# EAGLE design ChessComputer (EAGLE 7.6.0)

## Sheet 1 of 2
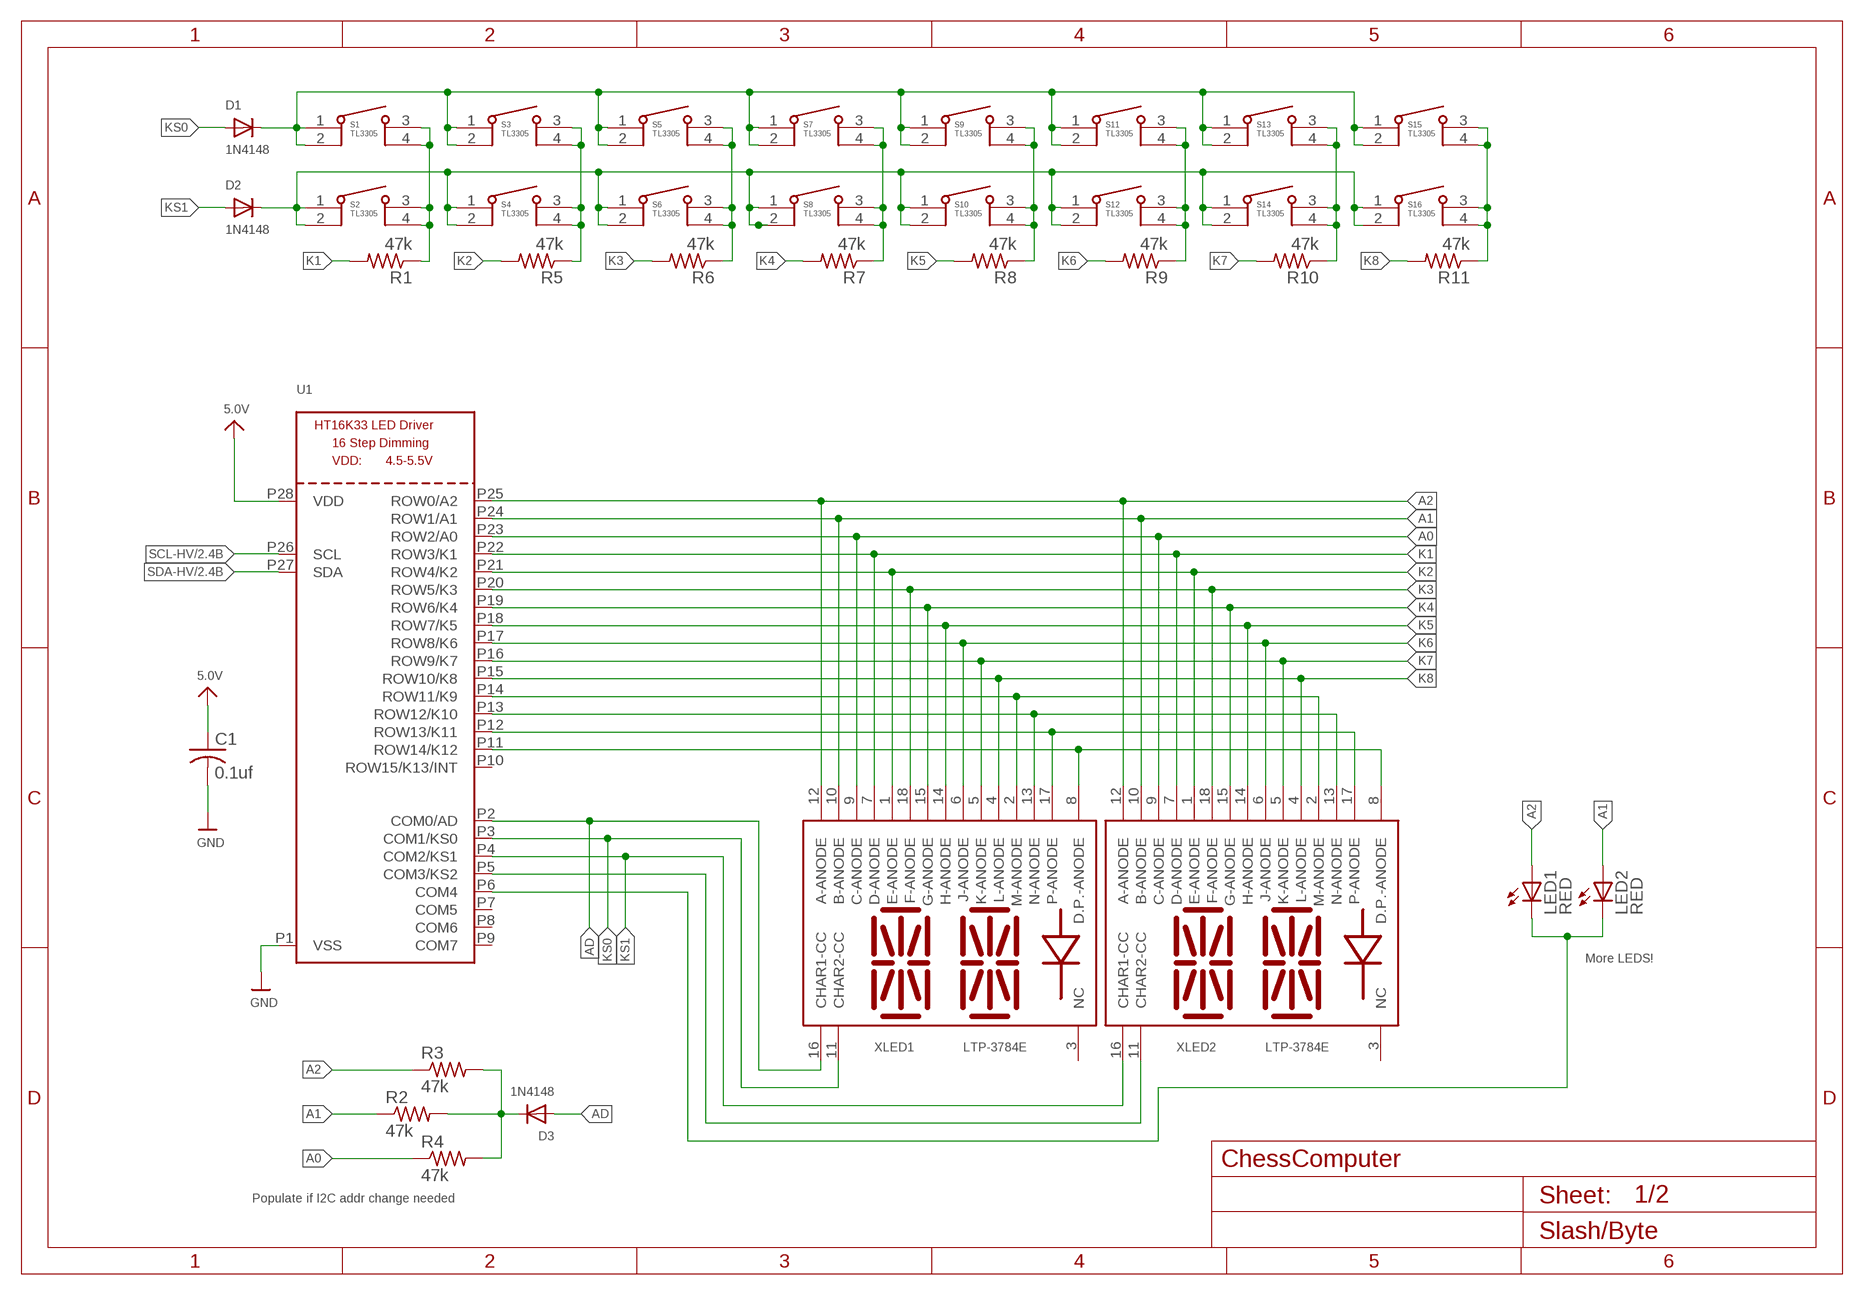
[diagram p0: schematic, sheet 1]

### Parts
C1  0.1uf  C-USC0805K  [C0805K]
D1  1N4148  DIODESOD-523  [SOD-523]
D2  1N4148  DIODESOD-523  [SOD-523]
D3  1N4148  DIODESOD-523  [SOD-523]
LED1  RED  LED3MM  [LED3MM]
LED2  RED  LED3MM  [LED3MM]
R1  47k  R-US_M0805  [M0805]
R2  47k  R-US_M0805  [M0805]
R3  47k  R-US_M0805  [M0805]
R4  47k  R-US_M0805  [M0805]
R5  47k  R-US_M0805  [M0805]
R6  47k  R-US_M0805  [M0805]
R7  47k  R-US_M0805  [M0805]
R8  47k  R-US_M0805  [M0805]
R9  47k  R-US_M0805  [M0805]
R10  47k  R-US_M0805  [M0805]
R11  47k  R-US_M0805  [M0805]
S1  TL3305  [TL3305]
S2  TL3305  [TL3305]
S3  TL3305  [TL3305]
S4  TL3305  [TL3305]
S5  TL3305  [TL3305]
S6  TL3305  [TL3305]
S7  TL3305  [TL3305]
S8  TL3305  [TL3305]
S9  TL3305  [TL3305]
S10  TL3305  [TL3305]
S11  TL3305  [TL3305]
S12  TL3305  [TL3305]
S13  TL3305  [TL3305]
S14  TL3305  [TL3305]
S15  TL3305  [TL3305]
S16  TL3305  [TL3305]
U1  HT16K33_SOP28  [SOP28_300MIL]
XLED1  LTP-3784E  [TLP-3784E]
XLED2  LTP-3784E  [TLP-3784E]

### Nets
5.0V: C1.1 U1.P28(VDD) ; also sheet 2
A0: R4.1 U1.P23(ROW2/A0) XLED1.9(C-ANODE) XLED2.9(C-ANODE)
A1: LED2.A R2.1 U1.P24(ROW1/A1) XLED1.10(B-ANODE) XLED2.10(B-ANODE)
A2: LED1.A R3.1 U1.P25(ROW0/A2) XLED1.12(A-ANODE) XLED2.12(A-ANODE)
AD: D3.A U1.P2(COM0/AD) XLED1.16(CHAR1-CC)
GND: C1.2 U1.P1(VSS) ; also sheet 2
K1: R1.2 U1.P22(ROW3/K1) XLED1.7(D-ANODE) XLED2.7(D-ANODE)
K2: R5.2 U1.P21(ROW4/K2) XLED1.1(E-ANODE) XLED2.1(E-ANODE)
K3: R6.2 U1.P20(ROW5/K3) XLED1.18(F-ANODE) XLED2.18(F-ANODE)
K4: R7.2 U1.P19(ROW6/K4) XLED1.15(G-ANODE) XLED2.15(G-ANODE)
K5: R8.2 U1.P18(ROW7/K5) XLED1.14(H-ANODE) XLED2.14(H-ANODE)
K6: R9.2 U1.P17(ROW8/K6) XLED1.6(J-ANODE) XLED2.6(J-ANODE)
K7: R10.2 U1.P16(ROW9/K7) XLED1.5(K-ANODE) XLED2.5(K-ANODE)
K8: R11.2 U1.P15(ROW10/K8) XLED1.4(L-ANODE) XLED2.4(L-ANODE)
KS0: D1.A U1.P3(COM1/KS0) XLED1.11(CHAR2-CC)
KS1: D2.A U1.P4(COM2/KS1) XLED2.16(CHAR1-CC)
N$5: LED1.K(C) LED2.K(C) U1.P6(COM4)
N$12: U1.P14(ROW11/K9) XLED1.2(M-ANODE) XLED2.2(M-ANODE)
N$13: U1.P13(ROW12/K10) XLED1.13(N-ANODE) XLED2.13(N-ANODE)
N$14: U1.P12(ROW13/K11) XLED1.17(P-ANODE) XLED2.17(P-ANODE)
N$15: U1.P11(ROW14/K12) XLED1.8(D.P.-ANODE) XLED2.8(D.P.-ANODE)
N$17: D2.K(C) S2.1 S2.2 S4.1 S4.2 S6.1 S6.2 S8.1 S8.2 S10.1 S10.2 S12.1 S12.2 S14.1 S14.2 S16.1 S16.2
N$18: U1.P5(COM3/KS2) XLED2.11(CHAR2-CC)
N$22: D3.K(C) R2.2 R3.2 R4.2
N$25: R1.1 S1.3 S1.4 S2.3 S2.4
N$26: R5.1 S3.3 S3.4 S4.3 S4.4
N$32: R6.1 S5.3 S5.4 S6.3 S6.4
N$33: R7.1 S7.3 S7.4 S8.3 S8.4
N$34: R8.1 S9.3 S9.4 S10.3 S10.4
N$35: R9.1 S11.3 S11.4 S12.3 S12.4
N$37: D1.K(C) S1.1 S1.2 S3.1 S3.2 S5.1 S5.2 S7.1 S7.2 S9.1 S9.2 S11.1 S11.2 S13.1 S13.2 S15.1 S15.2
N$38: R10.1 S13.3 S13.4 S14.3 S14.4
N$39: R11.1 S15.3 S15.4 S16.3 S16.4
SCL-HV: U1.P26(SCL) ; also sheet 2
SDA-HV: U1.P27(SDA) ; also sheet 2
Unconnected: U1.P7(COM5) U1.P8(COM6) U1.P9(COM7) U1.P10(ROW15/K13/INT) XLED1.3(NC) XLED2.3(NC)

### Notes on the sheet
- More LEDS!
- Populate if I2C addr change needed

## Sheet 2 of 2
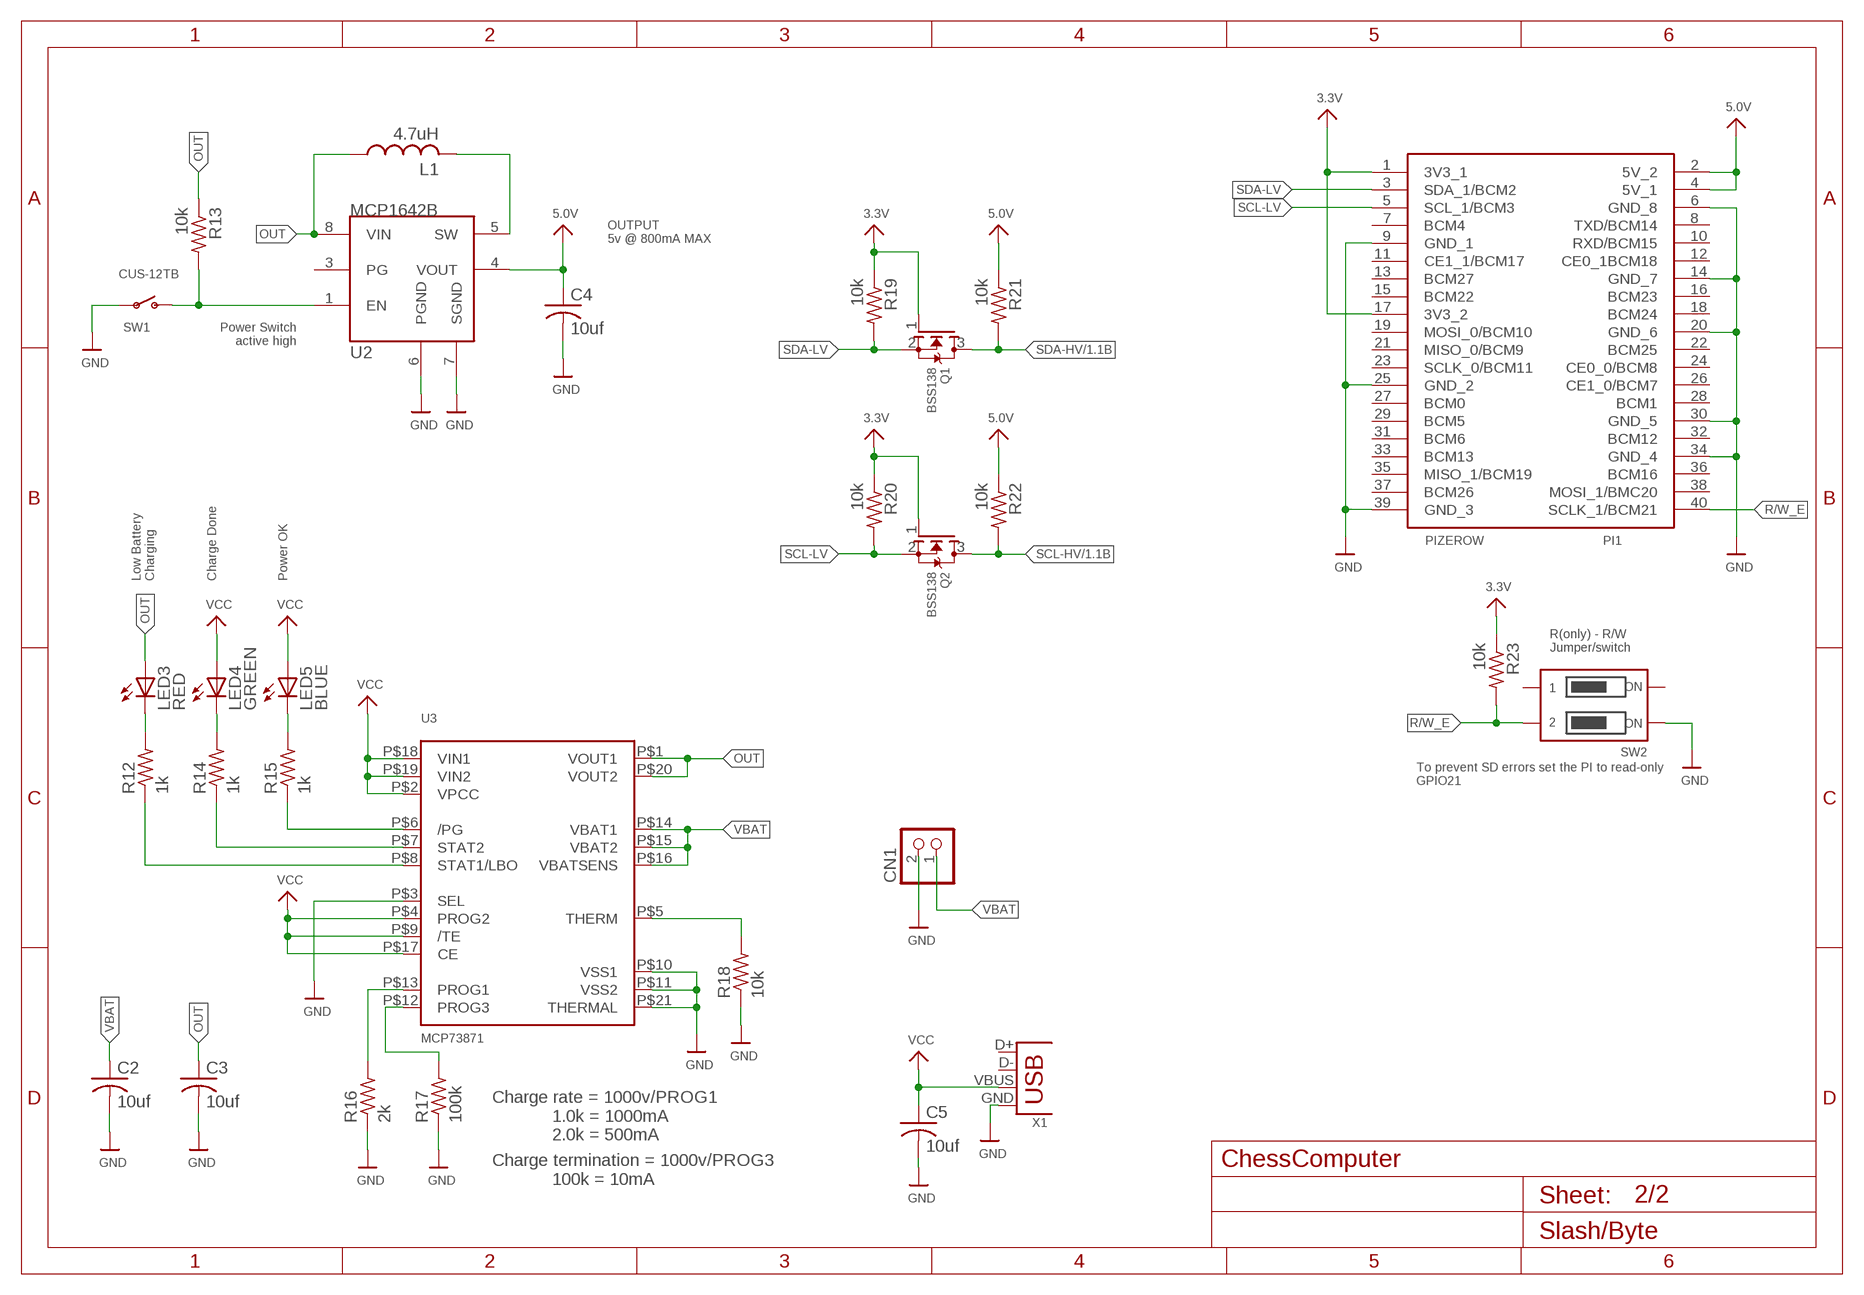
[diagram p1: schematic, sheet 2]

### Parts
C2  10uf  C-USC0805K  [C0805K]
C3  10uf  C-USC0805K  [C0805K]
C4  10uf  C-USC0805K  [C0805K]
C5  10uf  C-USC0805K  [C0805K]
CN1  JST_2PIN-SMT-RA  [JST-PH-2-SMT-RA]
L1  4.7uH  TYS60204R7N-10  [TYS60204R7N-10]
LED3  RED  LED3MM  [LED3MM]
LED4  GREEN  LED3MM  [LED3MM]
LED5  BLUE  LED3MM  [LED3MM]
PI1  PIZEROW  [RASP_PI_ZERO_BOARD_FULL]
Q1  BSS138  MOSFET-NREFLOW  [SOT23-R]
Q2  BSS138  MOSFET-NREFLOW  [SOT23-R]
R12  1k  R-US_M0805  [M0805]
R13  10k  R-US_M0805  [M0805]
R14  1k  R-US_M0805  [M0805]
R15  1k  R-US_M0805  [M0805]
R16  2k  R-US_M0805  [M0805]
R17  100k  R-US_M0805  [M0805]
R18  10k  R-US_M0805  [M0805]
R19  10k  R-US_M0805  [M0805]
R20  10k  R-US_M0805  [M0805]
R21  10k  R-US_M0805  [M0805]
R22  10k  R-US_M0805  [M0805]
R23  10k  R-US_M0805  [M0805]
SW1  CUS-12TB  SWITCH_SPST  [SPST_SMT_19192]
SW2  DIPSWITCH_2PIN  [DIPSWITCH_2PIN]
U2  MCP1642B  [MSOP8]
U3  MCP73871  [QFN20_4MM]
X1  MICRO-USB_ORIG  [DX4R005HJ5]

### Nets
3.3V: PI1.1(3V3_1) PI1.17(3V3_2) Q1.1(G) Q2.1(G) R19.1 R20.1 R23.1
5.0V: C4.1 PI1.2(5V_2) PI1.4(5V_1) R21.1 R22.1 U2.4(VOUT) ; also sheet 1
ENABLE: R13.2 SW1.C(S) U2.1(EN)
GND: C2.2 C3.2 C4.2 C5.2 CN1.2 PI1.6(GND_8) PI1.9(GND_1) PI1.14(GND_7) PI1.20(GND_6) PI1.25(GND_2) PI1.30(GND_5) PI1.34(GND_4) PI1.39(GND_3) R16.1 R17.1 R18.1 SW1.B(P) SW2.1A U2.6(PGND) U2.7(SGND) U3.P$3(SEL) U3.P$10(VSS1) U3.P$11(VSS2) U3.P$21(THERMAL) X1.GND ; also sheet 1
N$1: R18.2 U3.P$5(THERM)
N$2: R17.2 U3.P$12(PROG3)
N$3: R16.2 U3.P$13(PROG1)
N$4: L1.P$2 U2.5(SW)
N$6: R15.1 U3.P$6(/PG)
N$7: LED5.K(C) R15.2
N$8: LED4.K(C) R14.2
N$9: LED3.K(C) R12.2
N$10: R14.1 U3.P$7(STAT2)
N$11: R12.1 U3.P$8(STAT1/LBO)
OUT: C3.1 L1.P$1 LED3.A R13.1 U2.8(VIN) U3.P$1(VOUT1) U3.P$20(VOUT2)
R/W_E: PI1.40(SCLK_1/BCM21) R23.2 SW2.1B
SCL-HV: Q2.3(D) R22.2 ; also sheet 1
SCL-LV: PI1.5(SCL_1/BCM3) Q2.2(S) R20.2
SDA-HV: Q1.3(D) R21.2 ; also sheet 1
SDA-LV: PI1.3(SDA_1/BCM2) Q1.2(S) R19.2
VBAT: C2.1 CN1.1 U3.P$14(VBAT1) U3.P$15(VBAT2) U3.P$16(VBATSENS)
VCC: C5.1 LED4.A LED5.A U3.P$2(VPCC) U3.P$4(PROG2) U3.P$9(/TE) U3.P$17(CE) U3.P$18(VIN1) U3.P$19(VIN2) X1.VBUS
Unconnected: PI1.7(BCM4) PI1.8(TXD/BCM14) PI1.10(RXD/BCM15) PI1.11(CE1_1/BCM17) PI1.12(CE0_1BCM18) PI1.13(BCM27) PI1.15(BCM22) PI1.16(BCM23) PI1.18(BCM24) PI1.19(MOSI_0/BCM10) PI1.21(MISO_0/BCM9) PI1.22(BCM25) PI1.23(SCLK_0/BCM11) PI1.24(CE0_0/BCM8) PI1.26(CE1_0/BCM7) PI1.27(BCM0) PI1.28(BCM1) PI1.29(BCM5) PI1.31(BCM6) PI1.32(BCM12) PI1.33(BCM13) PI1.35(MISO_1/BCM19) PI1.36(BCM16) PI1.37(BCM26) PI1.38(MOSI_1/BMC20) SW2.2A SW2.2B U2.3(PG) X1.D+ X1.D-

### Notes on the sheet
- OUTPUT
  5v @ 800mA MAX
- Power Switch
  active high
- Low Battery
  Charging
- Charge Done | Power OK
- R(only) - R/W
  Jumper/switch
- To prevent SD errors set the PI to read-only
  GPIO21
- Charge rate = 1000v/PROG1
              1.0k = 1000mA
              2.0k = 500mA
- Charge termination = 1000v/PROG3
              100k = 10mA

## Library data of the parts
C1-C5 = adafruit:C-US: CAPACITOR, American symbol
CN1 = adafruit:JST_2PIN: JST 2-Pin Connectors of various flavors SMT-RA (S2B-PH-SM4) 4UConnector #17311 SMT (B2B-PH-SM4) THM-RA (S2B-PH) THM (B2B-PH)
D1-D3 = adafruit:DIODE: Diode SMADIODE - SMA Surface Mount Package 20V 1A Schottky Diode Digikey: 641-1014-6-ND DO-1N4148 - Through Hole Small Current Diode SOD-123 20V 1 A (.5mV Vf) Schottky Diode - Digikey: MBRX120TPMSCT-ND SOD-323 10V 570mA (.38mV Vf, 3ns) Schottky Diode - Digikey: ZLLS410CT-ND SOD-523 30V 30mA Schottky Diode (RB751S-40TE61) - Digikey: RB751S-40TE61CT-ND SOT23-R/W - SOT23 Package (R = Solder Paste/Reflow Ovens, W = Hand-Soldering) BAT54Film 40V 300mA - Digikey: 497-7162-1-ND
L1 = chessLib:TYS60204R7N-10: https://www.digikey.com/product-detail/en/laird-signal-integrity-products/TYS60204R7N-10/240-2724-1-ND/4733633
LED1-LED5 = adafruit:LED: LED OSRAM: - CHIPLED LG R971, LG N971, LY N971, LG Q971, LY Q971, LO R971, LY R971 LH N974, LH R974 LS Q976, LO Q976, LY Q976 LO Q996 - Hyper CHIPLED LW Q18S LB Q993, LB Q99A, LB R99A - SideLED LS A670, LO A670, LY A670, LG A670, LP A670 LB A673, LV A673, LT A673, LW A673 LH A674 LY A675 LS A676, LA A676, LO A676, LY A676, LW A676 LS A679, LY A679, LG A679 - Hyper Micro SIDELED® LS Y876, LA Y876, LO Y876, LY Y876 LT Y87S - SmartLED LW L88C, LW L88S LB L89C, LB L89S, LG L890 LS L89K, LO L89K, LY L89K LS L896, LA L896, LO L896, LY L896 - TOPLED LS T670, LO T670, LY T670, LG T670, LP T670 LSG T670, LSP T670, LSY T670, LOP T670, LYG T670 LG T671, LOG T671, LSG T671 LB T673, LV T673, LT T673, LW T673 LH T674 LS T676, LA T676, LO T676, LY T676, LB T676, LH T676, LSB T676, LW T676 LB T67C, LV T67C, LT T67C, LS T67K, LO T67K, LY T67K, LW E67C LS E67B, LA E67B, LO E67B, LY E67B, LB E67C, LV E67C, LT E67C LW T67C LS T679, LY T679, LG T679 LS T770, LO T770, LY T770, LG T770, LP T770 LB T773, LV T773, LT T773, LW T773 LH T774 LS E675, LA E675, LY E675, LS T675 LS T776, LA T776, LO T776, LY T776, LB T776 LHGB T686 LT T68C, LB T68C - Hyper Mini TOPLED® LB M676 - Mini TOPLED Santana® LG M470 LS M47K, LO M47K, LY M47K Source: http://www.osram.convergy.de/
PI1 = chessLib:PIZEROW
Q1 Q2 = microbuilder:MOSFET-N: N-Channel Mosfet LEGEND VDS: Voltage Drain-Source ID: Drain Current RDS(ON): Drain-Source On-State Resistance VGS(TH): Gate-Source Threshold Voltage CISS: Drain-Source Input Capacitance SOT-23 Name VDS ID RDS(ON) VGS(TH) CISS Order Number 2N7002E 60V 260mA 2.5 Ohm 2.5V @ 250uA 26.7pF @ 25V 2N7002ET1GOSTR-ND BSH103 30V 850mA 400 mOhm 400mV @ 1mA 83pF @ 24V BSH103,235-ND BSS138 60V 320mA 1.6 Ohm 1.5V @ 250uA 50pF @ 10V Mouser: 771-BSS138PW115 DMN2075U-7 20V 4.2A 38 mOhm 1V @ 250 uA 594.3pF @ 10V DMN2075U-7DICT-ND * BSS138 good choice for I2C level-shifting
R1-R23 = adafruit:R-US_: RESISTOR, American symbol
S1-S16 = chessLib:TL3305
SW1 = microbuilder:SWITCH_SPST: Switch - SPST 4UCon 19192 (6.7x2.6mm SMT)
SW2 = chessLib:DIPSWITCH_2PIN: DIP Switch - 2 Pin - [4UConnector: 19493]
U1 = microbuilder:HT16K33_SOP28
U2 = chessLib:MCP1642B: MCP1642B http://ww1.microchip.com/downloads/en/DeviceDoc/20005253A.pdf digikey: MCP1642B-50I/MS-ND
U3 = microbuilder:MCP73871: MCP73871 Lithium Polymer Battery Charger Digikey: MCP73871-2CCI/ML-ND
X1 = fab:MICRO-USB: SMD micro USB connector as found in the fablab inventory. Three footprint variants included: original, as described by manufacturer's datasheet for milling with the 1/100" bit for milling with the 1/64" bit Made by Zaerc.
XLED1 XLED2 = chessLib:LTP-3784E

## Board
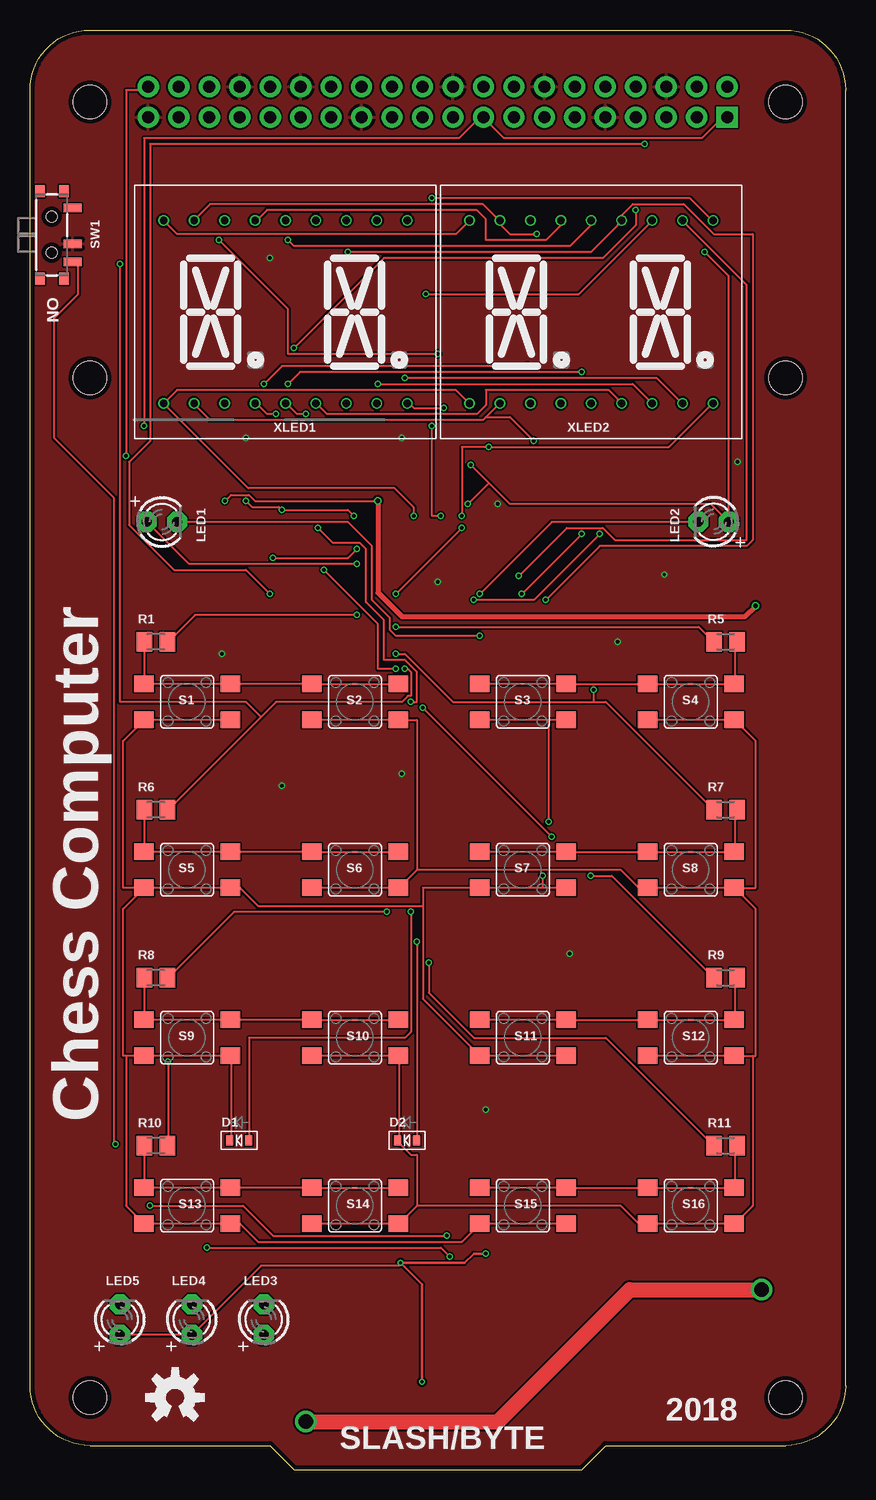
[diagram p2: board, top side]
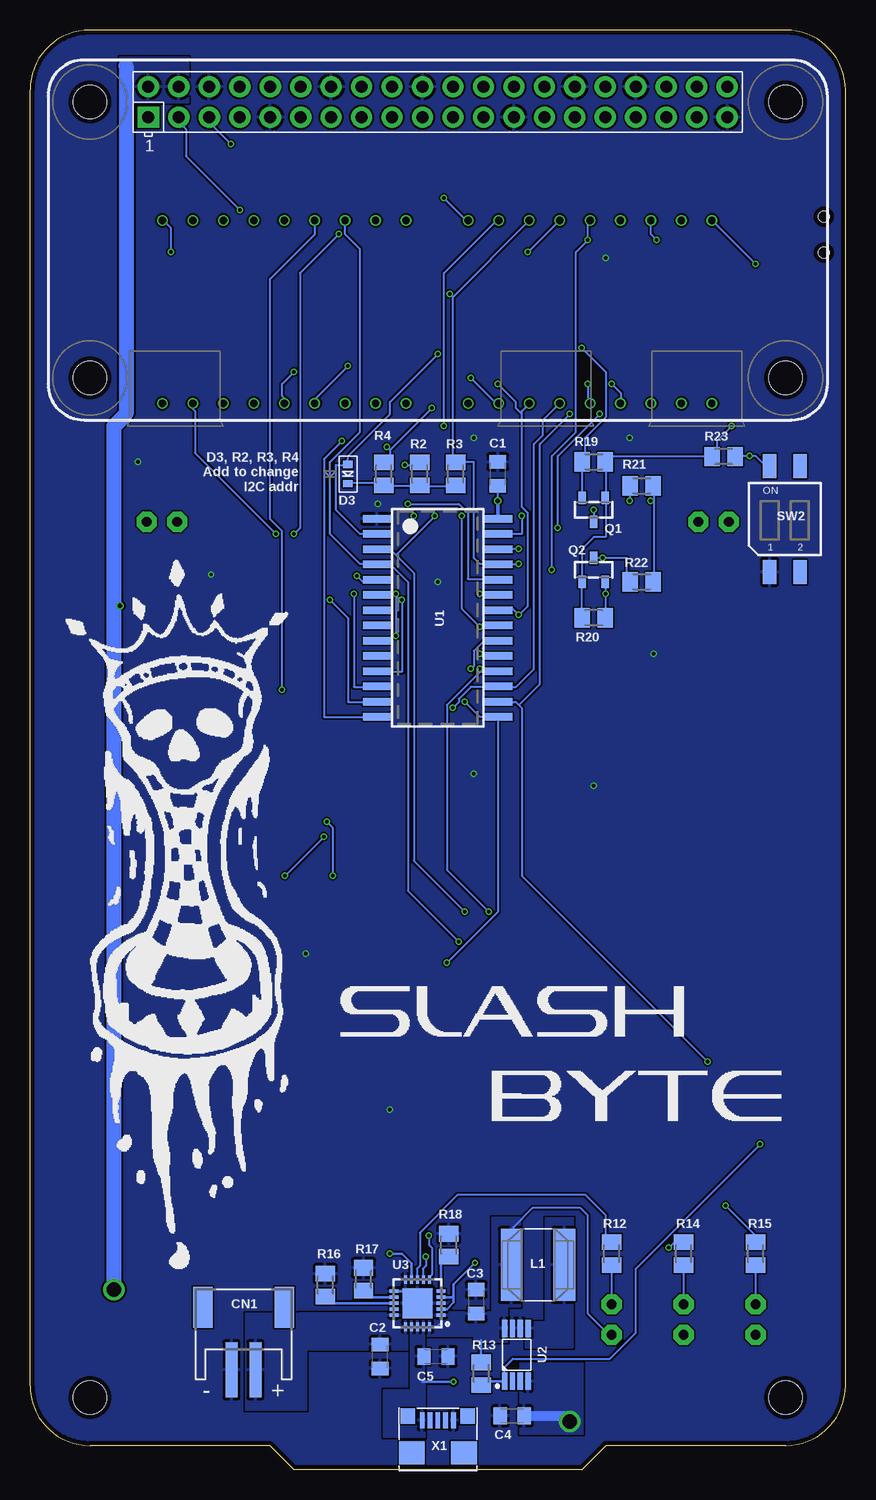
[diagram p3: board, bottom side, seen from below]

Size 68 x 120 mm. Coordinates in mm from the lower left corner, seen from the top.
Outline: 22,0 46,0 48,2 63,2 arc90 68,7 68,115 arc90 63,120 5,120 arc90 0,115 0,7 arc90 5,2 20,2 22,0
Copper layers (1*16): Top 0.035559375mm / dielectric 1.6mm / Bottom 0.035559375mm
Design rules "oshpark-2layer": minimum track width 6mil, minimum drill 10mil, track to track 6mil, track to pad 6mil, pad to pad 6mil, via to via 6mil, smd to smd 6mil, copper to edge 15mil, drill to drill 6mil, minimum pad ring 5mil, minimum via ring 5mil, stop-mask expansion 2.5mil, vias tented up to drill 0mil, thermal gap 10mil
Holes 2.75 mm at 5,6 63,6

### Footprints (pad centres in the part's own frame; a part is rotated, then mirrored left to right if it is on the bottom)
C0805K = smd 1.1 x 1.4: 1 -1,0; 2 1,0
JST-PH-2-SMT-RA = smd 1 x 4.6: 1 1,-3.7; 2 -1,-3.7 | smd 1.6 x 3.4: NC1 -3.4,1.5; NC2 3.4,1.5
SOD-523 = smd 0.8 x 0.6: A 0,-0.8; K 0,0.8
TYS60204R7N-10 = smd 1.8 x 6: P$1 0,0; P$2 4.4,0
LED3MM = drill 0.813 pad 1.676 octagon: A -1.27,0; K 1.27,0
RASP_PI_ZERO_BOARD_FULL = drill 1 pad 1.778 square: 1 8.37,25.23 | drill 1 pad 1.778: 2 8.37,27.77; 3 10.91,25.23; 4 10.91,27.77; 5 13.45,25.23; 6 13.45,27.77; 7 15.99,25.23; 8 15.99,27.77; 9 18.53,25.23; 10 18.53,27.77; 11 21.07,25.23; 12 21.07,27.77; 13 23.61,25.23; 14 23.61,27.77; 15 26.15,25.23; 16 26.15,27.77; 17 28.69,25.23; 18 28.69,27.77; 19 31.23,25.23; 20 31.23,27.77; 21 33.77,25.23; 22 33.77,27.77; 23 36.31,25.23; 24 36.31,27.77; 25 38.85,25.23; 26 38.85,27.77; 27 41.39,25.23; 28 41.39,27.77; 29 43.93,25.23; 30 43.93,27.77; 31 46.47,25.23; 32 46.47,27.77; 33 49.01,25.23; 34 49.01,27.77; 35 51.55,25.23; 36 51.55,27.77; 37 54.09,25.23; 38 54.09,27.77; 39 56.63,25.23; 40 56.63,27.77 | hole 2.75: 3.5,3.5; 3.5,26.5; 61.5,3.5; 61.5,26.5
SOT23-R = smd 0.635 x 1.016: 1 -0.95,-1; 2 0.95,-1; 3 0,1
M0805 = smd 1.3 x 1.6: 1 -0.95,0; 2 0.95,0
TL3305 = smd 1.6 x 1.4: 1 -7.2,-3; 2 0,-3; 3 -7.2,0; 4 0,0
SPST_SMT_19192 = smd 0.7 x 1.5: A -2.25,1.75; B 0.75,1.75; C 2.25,1.75 | smd 1 x 0.8: GND1 -3.65,1; GND2 -3.65,-1; GND3 3.65,1; GND4 3.65,-1 | hole 0.9: -1.5,0; 1.5,0
DIPSWITCH_2PIN = smd 1.1 x 2: 1A -1.27,-4.4; 1B -1.27,4.4; 2A 1.27,-4.4; 2B 1.27,4.4
SOP28_300MIL = smd 0.635 x 2.286: P1 -8.255,-5.08; P2 -6.985,-5.08; P3 -5.715,-5.08; P4 -4.445,-5.08; P5 -3.175,-5.08; P6 -1.905,-5.08; P7 -0.635,-5.08; P8 0.635,-5.08; P9 1.905,-5.08; P10 3.175,-5.08; P11 4.445,-5.08; P12 5.715,-5.08; P13 6.985,-5.08; P14 8.255,-5.08; P15 8.255,5.08; P16 6.985,5.08; P17 5.715,5.08; P18 4.445,5.08; P19 3.175,5.08; P20 1.905,5.08; P21 0.635,5.08; P22 -0.635,5.08; P23 -1.905,5.08; P24 -3.175,5.08; P25 -4.445,5.08; P26 -5.715,5.08; P27 -6.985,5.08; P28 -8.255,5.08
MSOP8 = smd 0.45 x 1.45: 1 0,-4.4; 2 0.65,-4.4; 3 1.3,-4.4; 4 1.95,-4.4; 5 1.95,0; 6 1.3,0; 7 0.65,0; 8 0,0
QFN20_4MM = smd 0.73 x 0.28: P$1 -1.965,1; P$2 -1.965,0.5; P$3 -1.965,0; P$4 -1.965,-0.5; P$5 -1.965,-1; P$11 1.965,-1; P$12 1.965,-0.5; P$13 1.965,0; P$14 1.965,0.5; P$15 1.965,1 | smd 0.28 x 0.73: P$6 -1,-1.965; P$7 -0.5,-1.965; P$8 0,-1.965; P$9 0.5,-1.965; P$10 1,-1.965; P$16 1,1.965; P$17 0.5,1.965; P$18 0,1.965; P$19 -0.5,1.965; P$20 -1,1.965 | smd 2.5 x 2.5: P$21 0,0
DX4R005HJ5 = smd 0.4 x 1.35: D+ 0,1.6; D- -0.65,1.6; GND 1.3,1.6; ID 0.65,1.6; VBUS -1.3,1.6 | smd 1.2 x 1.3: GND@1 -2.5,1.95; GND@2 2.5,1.95 | smd 2.15 x 1.9: GND@3 -2.175,-1.1; GND@4 2.175,-1.1
TLP-3784E = drill 0.6: 1 -10.16,-7.62; 2 -7.62,-7.62; 3 -5.08,-7.62; 4 -2.54,-7.62; 5 0,-7.62; 6 2.54,-7.62; 7 5.08,-7.62; 8 7.62,-7.62; 9 10.16,-7.62; 10 10.16,7.62; 11 7.62,7.62; 12 5.08,7.62; 13 2.54,7.62; 14 0,7.62; 15 -2.54,7.62; 16 -5.08,7.62; 17 -7.62,7.62; 18 -10.16,7.62

### Placement (x,y rotation side)
C1  29,83 90 bottom
C2  38.82,9.42 270 bottom
C3  30.8,14 90 bottom
C4  27.8,4.47 180 bottom
C5  34.14,9.42 0 bottom
CN1  50.19,12.02 0 bottom
D1  17.44,27.44 90 top
D2  31.44,27.44 90 top
D3  41.5,83 180 bottom
L1  27.84,17.05 0 bottom
LED1  11,79 0 top
LED2  57,79 180 top
LED3  19.5,12.5 90 top
LED4  13.5,12.5 90 top
LED5  7.5,12.5 90 top
PI1  66.5,87.5 0 bottom
Q1  21,80 180 bottom
Q2  21,75 0 bottom
R1  10.5,69 0 top
R2  35.5,83 270 bottom
R3  32.5,83 270 bottom
R4  38.5,83 270 bottom
R5  58,69 180 top
R6  10.5,55 0 top
R7  58,55 180 top
R8  10.5,41 0 top
R9  58,41 180 top
R10  10.5,27 0 top
R11  58,27 180 top
R12  19.5,18 270 bottom
R13  30.38,7.99 270 bottom
R14  13.5,18 270 bottom
R15  7.5,18 270 bottom
R16  43.38,15.37 270 bottom
R17  40.18,15.86 270 bottom
R18  33.08,18.7 270 bottom
R19  21,84 180 bottom
R20  21,71 0 bottom
R21  17,82 180 bottom
R22  17,74 180 bottom
R23  10.16,84.44 0 bottom
S1  16.7,65.5 0 top
S2  30.7,65.5 0 top
S3  44.7,65.5 0 top
S4  58.7,65.5 0 top
S5  16.7,51.5 0 top
S6  30.7,51.5 0 top
S7  44.7,51.5 0 top
S8  58.7,51.5 0 top
S9  16.7,37.5 0 top
S10  30.7,37.5 0 top
S11  44.7,37.5 0 top
S12  58.7,37.5 0 top
S13  16.7,23.5 0 top
S14  30.7,23.5 0 top
S15  44.7,23.5 0 top
S16  58.7,23.5 0 top
SW1  1.82,102.93 270 top
SW2  5.06,79.23 0 bottom
U1  34,71 270 bottom
U2  28.42,11.76 0 bottom
U3  35.69,13.87 180 bottom
U$1  [OSHW-LOGO-M]  12.1,6 0 top
U$2  [CHESSLOGO1]  66.5,16 0 bottom
U$3  [SLASHBYTE]  44,27 0 bottom
X1  34,2.5 0 bottom
XLED1  21.3,96.5 0 top
XLED2  46.8,96.5 0 top

### Tracks (layer width: path | path; a pad name or v marks a point on that pad's centre or on a via)
3.3V  (via drill 0.25)
  Top 0.152: PI1.1 58,112.5 57.5,112.5 56,111 39.5,111 38,112.5 PI1.17 37.75,112.5 37.25,112.5 35.75,111 9.5,111 v9.5,87
  Bottom 0.152: 22,74 22,71 R20.1 | 20,84 20,81 | 20,84 20,84.5 11.25,84.5 R23.1 11,84.5 10.75,84.75 10.75,85.75 v9.5,87 | 20,84 R19.1 | 22,74 22,76.75 21,77.75 20,77.75 20,81 | 22,74 Q2.1 | 20,81 Q1.1
5.0V  (via drill 0.25, 0.4, 1.2)
  Top 0.152: v29,80.75 18.75,80.75 18.25,81.25 16.75,81.25 v16.25,80.75
  Top 0.406: v29,80.75 29,73.1 31,71.1 59.6,71.1 v60.5,72
  Top 1.27: v23,4 39,4 50,15 v61,15
  Bottom 0.152: C1.1 v29,80.75 29,80.7 29,79.5 U1.P28 29,79.25 | 16,80.75 16,82 R21.1 | 16,80.75 16,74 R22.1 | 16,80.75 v16.25,80.75 | v60.5,72 61,72
  Bottom 0.305: 29,79.25 29,80.7
  Bottom 0.813: C4.1 23.47,4.47 v23,4
  Bottom 1.27: v61,15 61,72 61,87 60,88 60,117
  pour Bottom (rank 2): 21.93,2.97 27.1,2.97 27.1,8.81 21.93,8.81
  pour Bottom: 54.8,117.7 60.5,117.7 60.5,114 54.8,114
A0  (via drill 0.25)
  Top 0.152: v34.5,88.5 32,88.5 31.75,88.75 31.5,88.75 XLED1.9 | XLED2.9 56.75,88.75 53.25,85.25 v38.25,85.25 36,85.25 v36,79.5 | v36,78.5 v30.5,73
  Bottom 0.152: 38,85 38,84.5 38.5,84 R4.1 | v34.5,88.5 38,85 | 38,85 v38.25,85.25 | v30.5,73 29,73 U1.P23 | v36,79.5 v36,78.5
A1  (via drill 0.25)
  Top 0.152: v33.5,106 55,106 56.75,104.25 XLED2.10 | 38.25,82.25 40,80.5 56.75,80.5 57.75,79.5 | 38.25,82.25 v36.75,83.75 | 57.75,79.5 58.25,79 LED2.A 57.75,79.5 | 38.25,82.25 v36.5,80.5 | v56.25,101.5 58.25,99.5 58.25,79.5 57.75,79.5
  Bottom 0.152: v33.5,106 31.75,104.25 31.5,104.25 XLED1.10 | v36.75,83.75 35.5,83.75 R2.1 | v36.5,80.5 32.25,80.5 31.5,79.75 31.5,74.25 29,74.25 U1.P24 | v56.25,101.5 56.25,103.5 56.75,104 XLED2.10
A2  (via drill 0.25)
  Top 0.152: v33,98 45.75,98 51.75,104 XLED2.12 | v27.25,75.5 13.25,75.5 9.75,79 LED1.A
  Bottom 0.152: 32.5,84 31,84 31,76 30.5,75.5 29,75.5 U1.P25 28.75,75.5 v27.25,75.5 | 32.75,97.75 XLED1.12 | 32.75,97.75 32.75,84.25 32.5,84 | 32.5,84 R3.1 | 32.75,97.75 v33,98
AD  (via drill 0.25)
  Top 0.152: v15.75,102.5 21.5,96.75 21.5,93 v34,93
  Bottom 0.152: 41.75,83.75 42.5,83.75 42.5,80 40.5,78 39.25,78 U1.P2 | 41.75,83.75 41.5,83.75 D3.A 41.75,83.75 | v15.75,102.5 16.25,103 16.25,104 XLED1.16 | v34,93 38,89 38,88 41.5,84.5 41.5,84.25 41.75,84 41.75,83.75
ENABLE  (via drill 0.25)
  Top 0.152: SW1.C 3.62,100.62 3.62,100.47 4.03,100.47 4,100.45 4,98 2,96 2,86 7,81 7,27.25 v7.12,27.12 7.2,27.2
  Bottom 0.152: v7.12,27.12 17.5,16.75 17.5,11.4 19.65,9.25 27.75,9.25 28.5,8.5 28.5,7.44 U2.1 | 29.12,7.38 29.12,7.36
  Bottom 0.2: U2.1 29.12,7.36 30.06,7.36 R13.2
GND  (via drill 0.25)
  Bottom 0.2: U3.P$11 36.64,14.87 36.59,14.82 36.59,14.77 U3.P$21
  other vias: 38,30 21,57 45,43 31,58 49,69 16,68 20,101 18,86 34,74 31,86 39,80.5 59,84 52.9,74.6
  pour Bottom (rank 6): -1,-2 69,-2 69,122 -1,122
  pour Top: -1,-2 70,-2 70,123 -1,123
K1  (via drill 0.25)
  Top 0.152: v27.25,71.25 13.75,71.25 11.5,69 R1.2 | v29,90.5 50.25,90.5 51.75,89 XLED2.7
  Bottom 0.152: U1.P22 28.75,71.75 27.75,71.75 v27.25,71.25 26.5,72 26.5,79.75 27,80.25 27,88 | 27,88 27,88.25 26.5,88.75 XLED1.7 | v29,90.5 27.5,89 27.5,88.5 27,88
K2  (via drill 0.25)
  Top 0.152: XLED2.1 36.5,89 35.5,90 12.25,90 11.25,89 XLED1.1 11.25,88.75 18.2,81.8 30.4,81.8 32,80.2 v32,79.5 | v30.5,70.25 55.75,70.25 57,69 R5.2
  Bottom 0.152: U1.P21 29,70.5 30.25,70.5 v30.5,70.25 32,71.75 v32,79.5
K3  (via drill 0.25)
  Top 0.152: XLED1.18 11.25,104 12.25,103 35.5,103 36.5,104 XLED2.18 | 19.25,62.75 20.5,64 31,64 31.5,64.5 31.75,64.5 31.75,66.5 31.5,66.75 v31.25,66.75 | 19.25,62.75 11.5,55 R6.2 | v7.5,100.5 7.5,64 18,64 19.25,62.75
  Bottom 0.152: v31.25,66.75 31,67 31,68.25 30,69.25 29,69.25 U1.P20 | v7.5,100.5 11,104 XLED1.18
K4  (via drill 0.25)
  Top 0.152: XLED1.15 19,104.25 19.75,105 37.25,105 38,104.25 38,102.5 43,102.5 44.5,104 XLED2.15 | 47,64 35.25,64 31.25,68 v30.5,68 | 47,64 48,64 57,55 R7.2 | 47,64 v47,65
  Bottom 0.152: v30.5,68 30.25,67.75 29,67.75 U1.P19 | v47,65 47,78.25 48,79.25 48,99.25 44.25,103 44.25,104 XLED2.15
K5  (via drill 0.25)
  Top 0.152: v21.5,102.5 22,102 45,102 47,104 XLED2.14 | v29.75,46.5 17,46.5 11.5,41 R8.2 | v24.5,75 29,70.5 29,66.75 v30.5,66.75
  Bottom 0.152: XLED1.14 21.5,104 v21.5,102.5 22.5,101.5 22.5,86.5 24.5,84.5 v24.5,75 | v29.75,46.5 33.25,50 33.25,63.75 30.5,66.5 | 30.5,66.5 29,66.5 U1.P18 | 30.5,66.5 v30.5,66.75
K6  (via drill 0.25)
  Top 0.152: XLED1.6 24,88.75 24.75,88 37.25,88 38,88.75 38,90 48.25,90 49,89.25 49,89 49.25,89 XLED2.6 | v46.75,49.5 48.5,49.5 57,41 R9.2 | v32.75,63.5 v43.5,52.75
  Bottom 0.152: v43.5,52.75 v46.75,49.5 | v32.75,63.5 32.25,64 32.25,64.25 31.25,65.25 29,65.25 U1.P17 28.75,65.25 27.5,65.25 26,66.75 26,85.5 25.25,86.25 25.25,87.5 24,88.75 XLED1.6
K7  (via drill 0.25)
  Top 0.152: v21.5,90.5 22.5,91.5 v46,91.5 | v11.5,34 11.5,27 R10.2 | v23,88 22.25,88 21.5,88.75 XLED1.5
  Bottom 0.152: v21.5,90.5 21.5,89 XLED1.5 | v46,91.5 47,90.5 47,89.5 46.75,89.25 46.75,89 XLED2.5 | v11.5,34 27,49.5 27,63.5 27.25,63.75 | 27.25,63.75 27.5,64 28.75,64 U1.P16 | v23,88 25.5,85.5 25.5,65.5 27.25,63.75
K8  (via drill 0.25)
  Top 0.152: v19.5,90.5 21,92 v41.5,92 | v33.25,42.25 33.25,39.75 37,36 48,36 57,27 R11.2 | v20.5,88 19.75,88 19,88.75 XLED1.4 | v24,78.5 25.25,77.25 27.5,77.25 28,76.75 28,72.3 29.5,70.8 29.5,67.5 31.25,67.5 32.25,66.5 32.25,64 v31.75,64
  Bottom 0.152: v19.5,90.5 18.75,89.75 18.75,89 XLED1.4 | v41.5,92 44.25,89.25 44.25,89 XLED2.4 | v33.25,42.25 29,46.5 29,62.5 U1.P15 29,62.75 30.5,62.75 v31.75,64 | v20.5,88 24,84.5 v24,78.5
KS0  (via drill 0.25)
  Top 0.152: v31.75,46.5 31.75,36.5 31.25,36 18.25,36 18.25,27.5 D1.A | v33.5,87 33.5,79.5 v34.25,79.5
  Bottom 0.152: v31.75,46.5 36,50.75 36,74.75 37.5,76.25 | 37.5,76.25 38,76.75 39,76.75 U1.P3 | v33.5,87 33.5,99.75 29.25,104 29,104 XLED1.11 | 37.5,76.25 v34.25,79.5
KS1  (via drill 0.25)
  Top 0.152: v32.25,44 32.25,27.5 D2.A
  Bottom 0.152: v32.25,44 36.5,48.25 36.5,74 38,75.5 39,75.5 U1.P4 39.25,75.5 40.5,75.5 43,78 43,84 40.5,86.5 40.5,101.75 41.75,103 41.75,104 XLED2.16
N$1
  Bottom 0.2: U3.P$5 33.73,17.11 R18.2
N$2
  Bottom 0.2: U3.P$12 39.64,14.37 R17.2
N$3
  Bottom 0.2: U3.P$13 42.83,13.87 R16.2
N$4
  pour Bottom (rank 2): 22.76,10.19 26.63,10.19 26.62,12.29 24.99,12.3 24.98,20.93 22.75,20.92
N$5  (via drill 0.25)
  Top 0.152: v37.5,73 43.5,79 LED2.K | LED1.K 26.5,79 28.5,77 28.5,72.5 30,71 30,70 30.5,69.5 v37.5,69.5
  Bottom 0.152: U1.P6 39,73 v37.5,73 v37.5,69.5
N$6  (via drill 0.25)
  Top 0.152: v34.75,19.5 20.25,19.5 17.75,22 v10,22
  Bottom 0.152: v34.75,19.5 34.75,18.75 34.5,18.5 34.5,16.25 34.75,16 U3.P$6 | v10,22 7.5,19.5 R15.1
N$7
  Bottom 0.152: LED5.K R15.2
N$8
  Bottom 0.152: LED4.K R14.2
N$9
  Bottom 0.152: LED3.K R12.2
N$10  (via drill 0.25)
  Top 0.152: v35,17.75 34.25,18.5 v14.75,18.5
  Bottom 0.152: v35,17.75 35,17 35.25,16.75 35.25,16 U3.P$7 | v14.75,18.5 14.25,19 13.5,19 R14.1
N$11
  Bottom 0.152: U3.P$8 35.75,16 35.75,16.75 35.5,17 35.5,19.75 32.35,22.9 21.7,22.9 20,21.2 20,19.5 19.5,19 R12.1
N$12  (via drill 0.25)
  Top 0.152: 38,87.75 39,88.75 XLED2.2 | 38,87.75 37.75,87.5 15,87.5 13.75,88.75 XLED1.2 | v42,85.75 40,87.75 38,87.75
  Bottom 0.152: v42,85.75 43.5,84.25 43.5,62.75 39.25,62.75 U1.P14
N$13  (via drill 0.25)
  Top 0.152: v26.5,101.5 46.75,101.5 49,103.75 49,104 | 49,104 49.25,104 XLED2.13 49,104 | v43,72.5 47.5,77 59.75,77 60.25,77.5 60.25,103 57,103 54.5,105.5 50.25,105.5 49,104.25 49,104
  Bottom 0.152: v26.5,101.5 24,104 XLED1.13 | v43,72.5 41.5,71 41.5,64 39.25,64 U1.P13
N$14  (via drill 0.25)
  Top 0.152: XLED1.17 13.75,104.25 15,105.5 37.75,105.5 39,104.25 XLED2.17 39,104 40,103 v42.25,103 | v46,78 v41,73
  Bottom 0.152: v41,73 41,65.25 39.25,65.25 U1.P12 | v46,78 45.5,78.5 45.5,99.75 v42.25,103
N$15  (via drill 0.25)
  Top 0.152: v31.25,91 52.25,91 54.25,89 XLED2.8 | v37,72.5 42,72.5 v47.5,78
  Bottom 0.152: v31.25,91 29.25,89 29,89 XLED1.8 | v37,72.5 37,66.5 39,66.5 U1.P11 | v47.5,78 54.25,84.75 54.25,88.25 54.75,88.75 54.5,89 XLED2.8
N$17
  Top 0.152: S4.1 S4.2 58.75,62.5 60.5,60.75 60.5,48.5 58.75,48.5 | S12.1 S12.2 60.25,34.5 | S6.1 S6.2 30.75,48.5 32.25,50 | S2.1 S2.2 32.25,62.5 32.25,50 | S14.1 S14.2 30.75,20.5 32.25,22 | S10.1 S10.2 30.75,34.5 30.75,27.5 D2.K 30.75,27.25 31.75,26.25 32.25,26.25 32.25,22 | 60.25,34.5 60.25,22 58.75,20.5 S16.2 S16.1 50.75,20.5 49.25,22 32.25,22 | 58.75,48.5 60.5,46.75 60.5,34.5 60.25,34.5 | 58.75,48.5 S8.2 S8.1 50.75,48.5 49.25,50 32.25,50
N$18  (via drill 0.25)
  Top 0.152: v40.75,74.5 44.75,78.5 47.75,78.5 48.75,77.5 59.75,77.5 59.75,98.75 54.5,104 XLED2.11
  Bottom 0.152: v40.75,74.5 40.25,74 39.25,74 U1.P5
N$22
  Bottom 0.152: D3.K 41.5,82.25 38.5,82.25 R4.2 38.5,82 35.5,82 | 35.5,82 32.5,82 R3.2 | 35.5,82 R2.2
N$25
  Top 0.152: R1.1 9.5,69 S1.3 S1.4 S2.3 S2.4
N$26
  Top 0.152: R5.1 58.75,69 58.75,65.5 S4.4 S4.3 S3.4 S3.3
N$32
  Top 0.152: R6.1 9.5,55 S5.3 S5.4 S6.3 S6.4
N$33
  Top 0.152: R7.1 58.75,55 58.75,51.5 S8.4 S8.3 S7.4 S7.3
N$34
  Top 0.152: R8.1 9.5,41 S9.3 S9.4 S10.3 S10.4
N$35
  Top 0.152: R9.1 58.75,41 58.75,37.5 S12.4 S12.3 S11.4 S11.3
N$37  (via drill 0.25)
  Top 0.152: S3.2 43.25,62.5 | 43.25,62.5 S3.1 | S11.2 S11.1 32.75,39.25 32.75,47 | S7.2 42.75,48.5 | 42.75,48.5 S7.1 32.75,48.5 32.75,47 | v43.25,54 43.25,62.5 | 42.75,48.5 v42.75,49.5 | S1.2 S1.1 7.75,60.75 7.75,48.5 S5.1 | S15.2 S15.1 36,19 19,19 17.5,20.5 S13.2 S13.1 8,22 8,34.5 | S5.1 S5.2 17.5,48.5 19,47 32.75,47 | D1.K 16.75,27.5 16.75,34.5 S9.2 S9.1 8,34.5 | S5.1 7.75,46.75 7.75,34.5 8,34.5
  Bottom 0.152: v43.25,54 42.75,53.5 v42.75,49.5
N$38
  Top 0.152: R10.1 9.5,27 S13.3 S13.4 S14.3 S14.4
N$39
  Top 0.152: R11.1 58.75,27 58.75,23.5 S16.4 S16.3 S15.4 S15.3
OUT
  Bottom 0.152: LED3.A 19.73,11.23 21.5,13 21.5,21.2 22.1,21.8 26.1,21.8 27.7,20.2 27.7,17.19 L1.P$1
  Bottom 0.2: 28.42,16.47 L1.P$1 | U3.P$1 33.73,12.23 34.05,11.9 U3.P$20 | R13.1 30.38,10.77
  pour Bottom (rank 3): 34.79,13.1 29.45,13.1 29.45,20.96 27.13,20.96 27.15,13.6 28.25,13.6 28.25,10.63 30.93,10.63 30.93,11.16 34.99,11.16 34.97,13.02
R/W_E  (via drill 0.25)
  Top 0.152: v8,84.5 8,115 9.5,115 9.75,115.25 PI1.40
  Bottom 0.152: R23.2 9,84.5 v8,84.5 7.5,84.5 6.5,83.5 SW2.1B
SCL-HV  (via drill 0.25)
  Top 0.152: v27.25,76.75 26.5,76 v20.25,76
  Bottom 0.152: Q2.3 v20.25,76 18.25,76 18.25,74.25 18,74 R22.2 | v27.25,76.75 28.75,76.75 U1.P26
SCL-LV  (via drill 0.25)
  Top 0.152: v20,73 18,75 12,75 8.25,78.75 8.25,84 10,85.75 10,110.5 v51.25,110.5
  Bottom 0.152: Q2.2 20,74 v20,73 20,71 R20.2 | v51.25,110.5 53,112.25 53,112.5 PI1.5
SDA-HV  (via drill 0.25)
  Top 0.152: v18,80.75 18.5,80.25 20.75,80.25 v21,80 26.5,80 v27,79.5
  Bottom 0.152: v21,80 Q1.3 | v18,80.75 18,82 R21.2 | v27,79.5 27,78 28.75,78 U1.P27
SDA-LV  (via drill 0.25)
  Top 0.152: v22,93.5 29.5,101 47.75,101 50.5,103.75 v50.5,105
  Bottom 0.152: Q1.2 22,81 22,84 R19.2 21.75,84 21.75,86 20,87.75 20,91.5 v22,93.5 | v50.5,105 55,109.5 55,111.75 55.5,112.25 55.5,112.5 PI1.3
VBAT
  Bottom 0.2: U3.P$15 U3.P$14
  pour Bottom (rank 2): 36.49,13.02 45.49,13.02 45.49,10.02 36.49,10.02
  pour Bottom: 45,13 45,5 50,5 50,13
VCC  (via drill 0.25)
  Top 0.152: 13.5,11.25 7.5,11.25 LED5.A | 13.5,11.25 19.25,17 30.75,17 v30.89,17.22 | 13.5,11.25 LED4.A
  Top 0.2: v32.69,7.32 32.69,15.42 v30.89,17.22 36.22,17.22 37,18 v38,18
  Bottom 0.2: U3.P$19 | 35.27,7.32 v32.69,7.32 | v30.89,17.22 32.69,15.42 32.69,14.52 | U3.P$2 33.24,13.37 32.69,13.92 32.69,14.52 | U3.P$4 32.84,14.37 32.69,14.52 | U3.P$9 36.19,17.19 37,18 v38,18
  pour Bottom: 35.13,12.51 35.11,2.75 38.49,2.75 38.49,6.6 36.23,6.6 36.23,12.51

### Text on the board
tPlace: ON | Chess Computer | 2018 | SLASH/BYTE
bPlace: D3, R2, R3, R4 / Add to change / I2C addr